# Altium schematic sheet 40_Controles.SchDoc
size A3; SheetNumber: 10; SheetTotal: 11
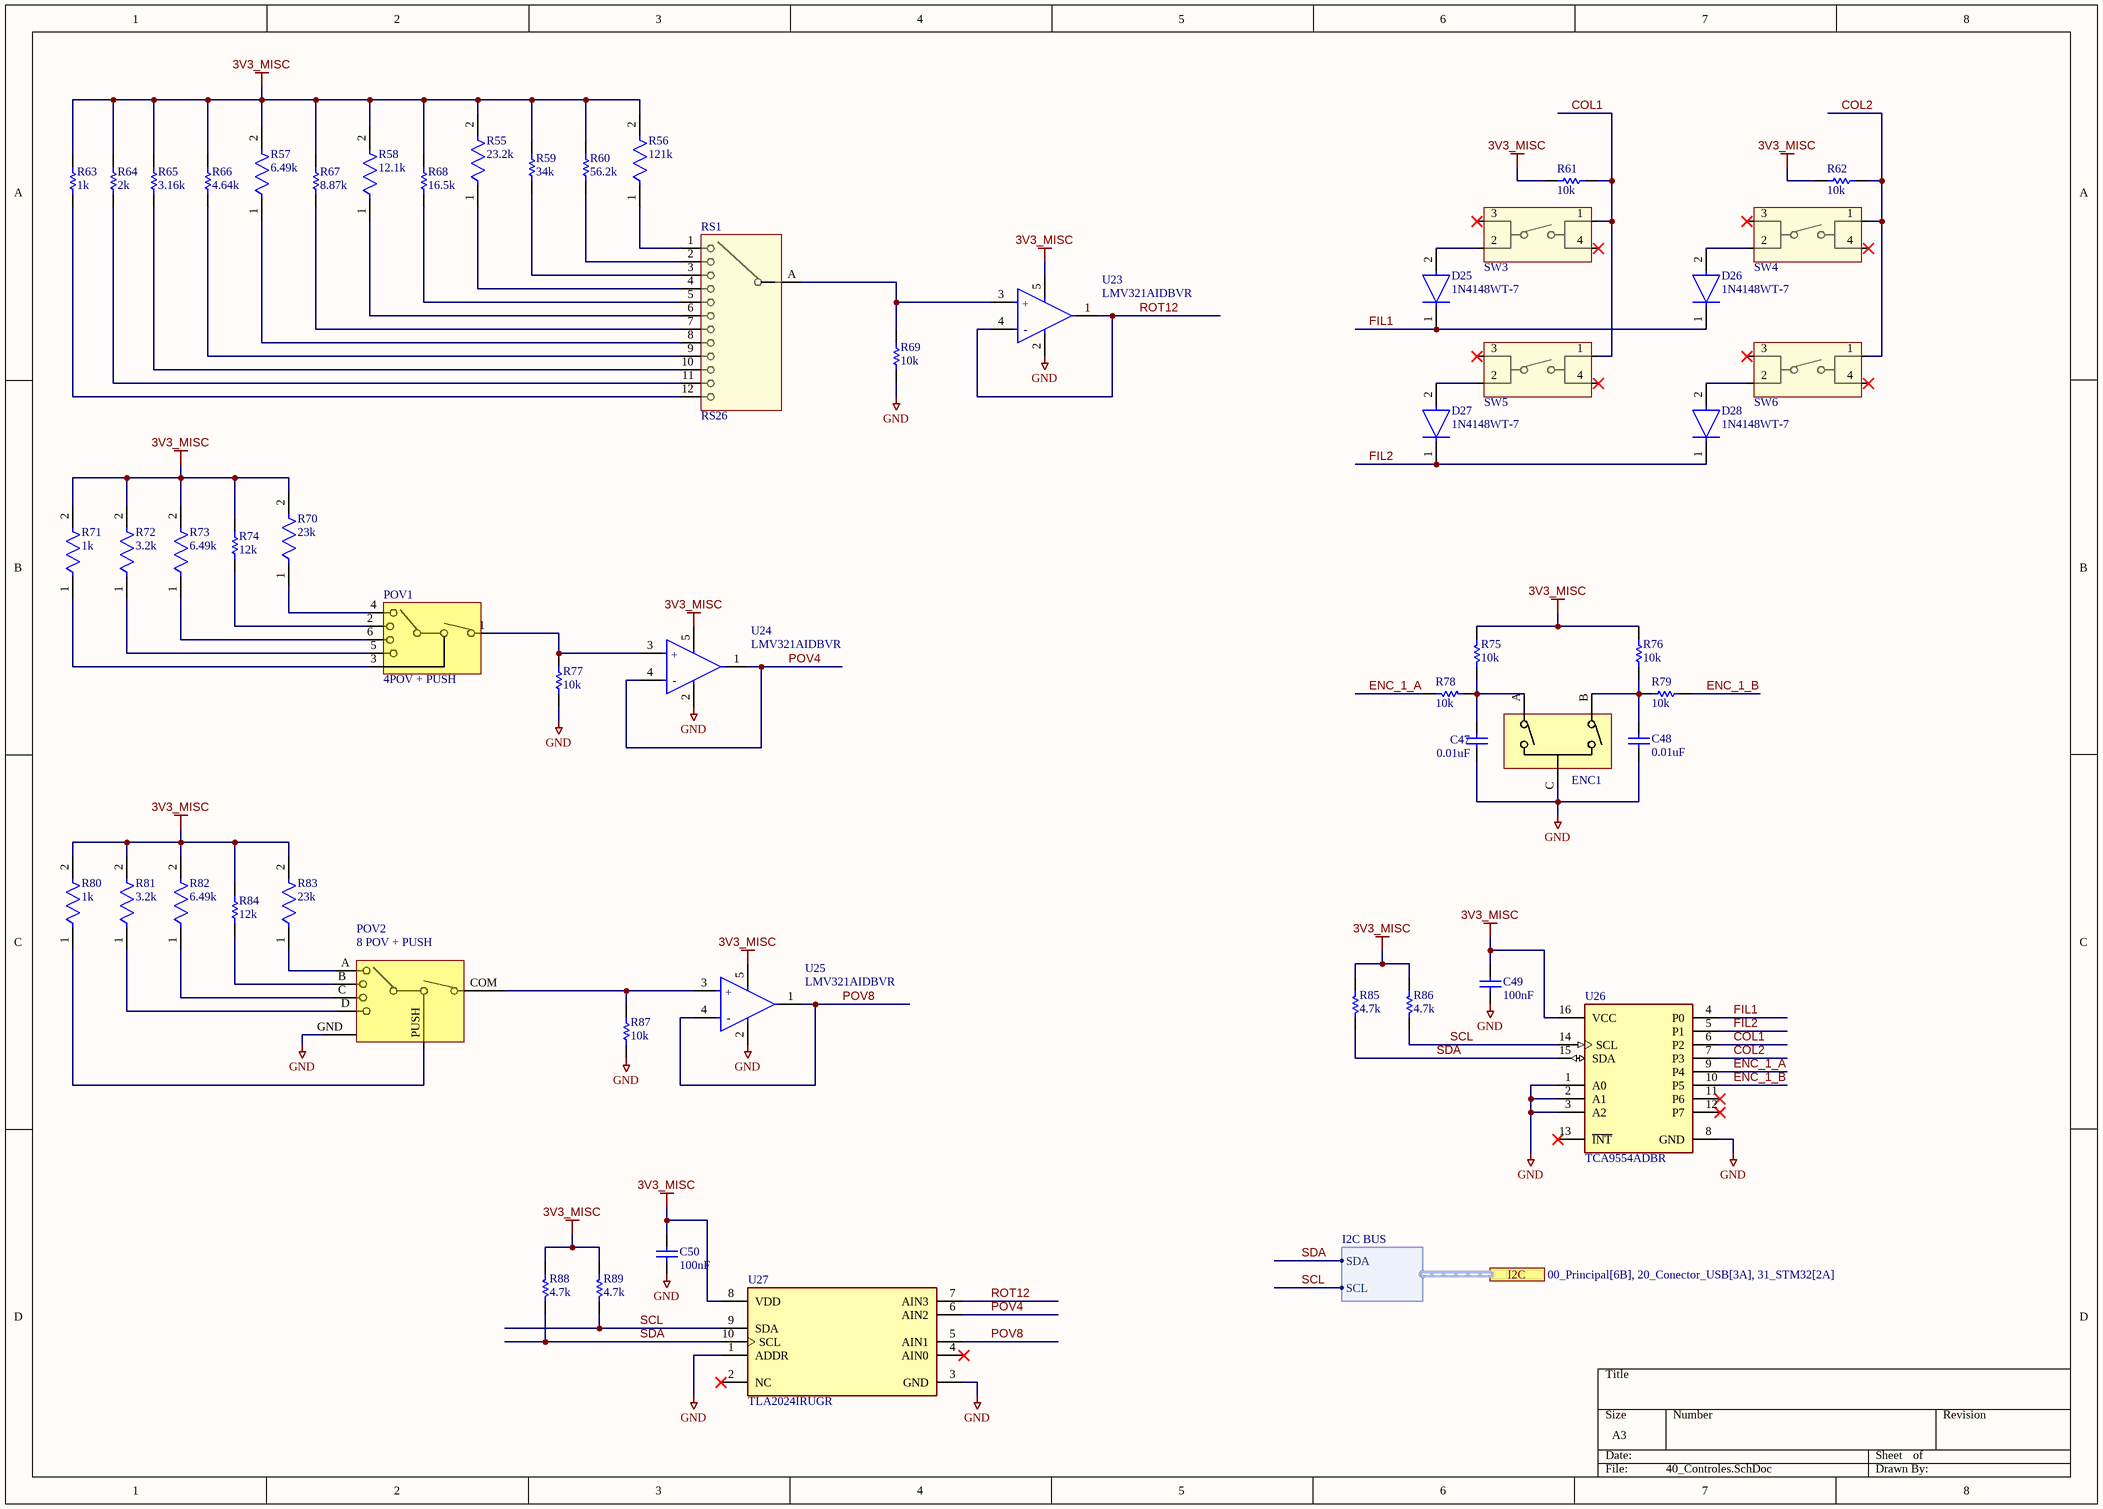
[diagram p0: 40_Controles.SchDoc]

## Parts
C47  0.01uF  [CAPC1005X55X25LL05T10]
C48  0.01uF  [CAPC1005X55X25LL05T10]
C49  100nF  [CAPC1005X55X25NL05T05]
C50  100nF  [CAPC1005X55X25NL05T05]
D25  1N4148WT-7  [FP-SOD523-MFG]
D26  1N4148WT-7  [FP-SOD523-MFG]
D27  1N4148WT-7  [FP-SOD523-MFG]
D28  1N4148WT-7  [FP-SOD523-MFG]
ENC1  Encoder  [PEC09-2315F-N0015]  (value not drawn)
POV1  4POV + PUSH  [TSSJ 30]
POV2  8 POV + PUSH  [RKJXM1015004]
R55  23.2k  [FP-ERJ2R-MFG]
R56  121k  [FP-ERJ2R-MFG]
R57  6.49k  [FP-ERJ2RK-MFG]
R58  12.1k  [FP-ERJ2RK-IPC_C]
R59  34k  [RESC1005X40X25LL05T05]
R60  56.2k  [RESC1005X40X25LL05T05]
R61  10k  [RESC1005X40X25ML05T05]
R62  10k  [RESC1005X40X25ML05T05]
R63  1k  [RESC1005X40X25NL05T05]
R64  2k  [RESC1005X40X25LL10T10]
R65  3.16k  [RESC1005X40X25ML05T05]
R66  4.64k  [RESC1005X40X25LL05T05]
R67  8.87k  [RESC1005X40X25NL05T05]
R68  16.5k  [RESC1005X40X25LL05T05]
R69  10k  [RESC1005X40X25ML05T05]
R70  23k  [FP-AC0402-MFG]
R71  1k  [FP-MCS0402-IPC_B]
R72  3.2k  [FP-RN73R1E-IPC_A]
R73  6.49k  [FP-MCS0402-IPC_A]
R74  12k  [RESC0402(1005)_M]
R75  10k  [RESC1005X40X25ML05T05]
R76  10k  [RESC1005X40X25ML05T05]
R77  10k  [RESC1005X40X25ML05T05]
R78  10k  [RESC1005X40X25ML05T05]
R79  10k  [RESC1005X40X25ML05T05]
R80  1k  [FP-MCS0402-IPC_B]
R81  3.2k  [FP-RN73R1E-IPC_A]
R82  6.49k  [FP-MCS0402-IPC_A]
R83  23k  [FP-AC0402-MFG]
R84  12k  [RESC0402(1005)_M]
R85  4.7k  [RESC1005X40X25ML05T10]
R86  4.7k  [RESC1005X40X25ML05T10]
R87  10k  [RESC1005X40X25ML05T05]
R88  4.7k  [RESC1005X40X25ML05T10]
R89  4.7k  [RESC1005X40X25ML05T10]
RS1  RS26  [RS26]
SW3  KSC441G70SHLFSPF  [KSC441G 70SH LFS PF]  (value not drawn)
SW4  KSC441G70SHLFSPF  [KSC441G 70SH LFS PF]  (value not drawn)
SW5  KSC441G70SHLFSPF  [KSC441G 70SH LFS PF]  (value not drawn)
SW6  KSC441G70SHLFSPF  [KSC441G 70SH LFS PF]  (value not drawn)
U23  LMV321AIDBVR  [FP-DBV0005A-MFG]
U24  LMV321AIDBVR  [FP-DBV0005A-MFG]
U25  LMV321AIDBVR  [FP-DBV0005A-MFG]
U26  TCA9554ADBR  [FP-DB0016A-MFG]
U27  TLA2024IRUGR  [FP-RUG0010A-MFG]

## Ports
I2C (harness I2C BUS, see 00_Principal[6B], 20_Conector_USB[3A], 31_STM32[2A])

## Harnesses
I2C BUS: SDA, SCL

## Nets
3V3_MISC: C49.2 C50.2 R55.2 R56.2 R57.2 R58.2 R59.2 R60.2 R61.2 R62.2 R63.2 R64.2 R65.2 R66.2 R67.2 R68.2 R70.2 R71.2 R72.2 R73.2 R74.2 R75.1 R76.1 R80.2 R81.2 R82.2 R83.2 R84.2 R85.2 R86.2 R88.2 R89.2 U23.5(V+) U24.5(V+) U25.5(V+) U26.16(VCC) U27.8(VDD)
GND: C47.1 C48.1 C49.1 C50.1 ENC1.C(COM) POV2.GND R69.1 R77.1 R87.1 U23.2(V-) U24.2(V-) U25.2(V-) U26.1(A0) U26.2(A1) U26.3(A2) U26.8(GND) U27.1(ADDR) U27.3(GND)
COL1: R61.1 SW3.1 SW5.1 U26.6(P2)
COL2: R62.1 SW4.1 SW6.1 U26.7(P3)
ENC_1_A: R78.1 U26.9(P4)
ENC_1_B: R79.1 U26.10(P5)
FIL1: D25.1(C) D26.1(C) U26.4(P0)
FIL2: D27.1(C) D28.1(C) U26.5(P1)
POV4: U24.1(OUT) U24.4(-IN) U27.6(AIN2)
POV8: U25.1(OUT) U25.4(-IN) U27.5(AIN1)
ROT12: U23.1(OUT) U23.4(-IN) U27.7(AIN3)
SCL: R86.1 R89.1 U26.14(SCL) U27.9(SDA) ; port I2C.SCL
SDA: R85.1 R88.1 U26.15(SDA) U27.10(SCL) ; port I2C.SDA
NetC47_2: C47.2 ENC1.A(COM) R75.2 R78.2
NetC48_2: C48.2 ENC1.B(COM) R76.2 R79.2
NetD25_2: D25.2(A) SW3.2
NetD26_2: D26.2(A) SW4.2
NetD27_2: D27.2(A) SW5.2
NetD28_2: D28.2(A) SW6.2
NetPOV1_1: POV1.1(COM) R77.2 U24.3(+IN)
NetPOV1_2: POV1.2(DIRB) R74.1
NetPOV1_3: POV1.3 R71.1
NetPOV1_4: POV1.4(DIRA) R70.1
NetPOV1_5: POV1.5(DIRD) R72.1
NetPOV1_6: POV1.6(DIRC) R73.1
NetPOV2_A: POV2.A(DIRA) R83.1
NetPOV2_B: POV2.B(DIRB) R84.1
NetPOV2_C: POV2.C(DIRC) R82.1
NetPOV2_COM: POV2.COM R87.2 U25.3(+IN)
NetPOV2_D: POV2.D(DIRD) R81.1
NetPOV2_PUSH: POV2.PUSH R80.1
NetR55_1: R55.1 RS1.4(A)
NetR56_1: R56.1 RS1.1(A)
NetR57_1: R57.1 RS1.8(A)
NetR58_1: R58.1 RS1.6(A)
NetR59_1: R59.1 RS1.3(A)
NetR60_1: R60.1 RS1.2(A)
NetR63_1: R63.1 RS1.12(A)
NetR64_1: R64.1 RS1.11(A)
NetR65_1: R65.1 RS1.10(A)
NetR66_1: R66.1 RS1.9(A)
NetR67_1: R67.1 RS1.7(A)
NetR68_1: R68.1 RS1.5(A)
NetR69_2: R69.2 RS1.A U23.3(+IN)

Not connected (* = marked no-connect by the designer): SW3 3(2)* 4(3)*; SW4 3(2)* 4(3)*; SW5 3(2)* 4(3)*; SW6 3(2)* 4(3)*; U26 11(P6)* 12(P7)* 13(~{INT})*; U27 2(NC)* 4(AIN0)*

## Notes on the sheet
- (in symbol CMP-04895-000333-1) +; -

## Library data of the parts
C47 C48 = CMP-1034-01880-2: Manufacturer: Murata; Part Number: GRM155R71E103KA01D
C49 C50 = CMP-2008-02030-1: Manufacturer: Vitramon; Part Number: VJ0402Y104KXJCW1BC
D25-D28 = CMP-2000-05518-3: DIODE GEN PURP 80V 125MA SOD523; Power Rating: 150mW; Peak Non-Repetitive Surge Current: 2A; Forward Voltage: 1.25V; Reverse Recovery Time: 4ns; Peak Reverse Current: 1uA; Max Repetitive Reverse Voltage (Vrrm): 100V; Capacitance: 2pF; Polarity: Standard; Element Configuration: Single; Forward Current: 250mA; Lead Free: Lead Free; Packaging: Tape and Reel; Length: 0.9mm; Min Operating Temperature: -65°C; Current Rating: 125mA; Max Reverse Voltage (DC): 80V; Width: 1.3mm; Package Quantity: 3000; Output Current: 125mA; Power Dissipation: 150mW; Max Operating Temperature: 150°C; Radiation Hardening: No; Average Rectified Current: 125mA; Height: 0.65mm; Voltage Rating (DC): 80V; Max Surge Current: 2A; Weight: 3.5E-05oz; Recovery Time: 4ns; Max Forward Surge Current (Ifsm): 2A; Contact Plating: Tin; Number of Pins: 2; Mount: Surface Mount; REACH SVHC: No SVHC
ENC1 = PEC09-2315F-N0015: PEC09 PC Pin Quadrature (Incremental) 12 Mechanical Encoder 11.4mm 70C; Manufacturer: Bourns; Built in Switch: No; Detent: Yes; Number of Circuits: 1; Output Type: Incremental, Quadrature; Pulses per Revolution: 12; Supplier: DigiKey; Supplier Part Number: 118-PEC09-2315F-N0015-ND; Manufacturer Part Number: PEC09-2315F-N0015; RoHS: Compliant; Category: Encoders; Stock: 1221; Pricing: 1=2.47, 10=2.078, 25=1.9392, 50=1.8398, 100=1.745, 300=1.60387, 500=1.54196, 1000=1.46156, 5000=1.29003 (USD); Country of Origin: Taiwan; Encoder Type: Mechanical; Introduction Date: 2010-10-15; Lifecycle Status: Production; Max Operating Temperature: 70°C; Min Operating Temperature: -10°C; Mounting Technology: PCB, Panel, Through Hole; Orientation: Right Angle; REACH SVHC: Yes; Schedule B: 8543709655; Termination: PC Pin; Width: 9.7mm; ComponentLink1URL: https://datasheet.octopart.com:443/PEC09-2315F-N0015-Bourns-datasheet-179971531.pdf?src-supplier=IHS; ComponentLink1Description: https://datasheet.octopart.com:443/PEC09-2315F-N0015-Bourns-datasheet-179971531.pdf?src-supplier=IHS; ComponentLink2URL: https://datasheet.octopart.com:443/PEC09-2315F-N0015-Bourns-datasheet-67810299.pdf?src-supplier=JRH+Electronics; ComponentLink2Description: https://datasheet.octopart.com:443/PEC09-2315F-N0015-Bourns-datasheet-67810299.pdf?src-supplier=JRH+Electronics; ComponentLink3URL: https://datasheet.octopart.com:443/PEC09-2315F-N0015-Bourns-datasheet-177040331.pdf?src-supplier=Burklin+Elektronik; ComponentLink3Description: https://datasheet.octopart.com:443/PEC09-2315F-N0015-Bourns-datasheet-177040331.pdf?src-supplier=Burklin+Elektronik; ComponentLink4URL: https://datasheet.octopart.com/PEC09-2315F-N0015-Bourns-datasheet-10938969.pdf; ComponentLink4Description: https://datasheet.octopart.com/PEC09-2315F-N0015-Bourns-datasheet-10938969.pdf; ComponentLink5URL: http://sigma.octopart.com:80/conflict_mineral_statement/Bourns-company-36.pdf?src-supplier=Compliance+Statements; ComponentLink5Description: http://sigma.octopart.com:80/conflict_mineral_statement/Bourns-company-36.pdf?src-supplier=Compliance+Statements
POV1 = TSSJ 30: SWITCH NAVIGATION 20MA 15V
POV2 = RKJXM1015004: 8-directional Stick Switch (with Center-push Function) RKJXM Series
R55 = CMP-1011-00662-3: RES SMD 23.2K OHM 1% 1/10W 0402; Manufacturer Part Number: ERJ-2RKF2322X; Manufacturer: Panasonic; Voltage Rating: 50V; Power Rating: 0.1W; Resistance: 23.2kΩ; Temperature Coefficient: 100%; Automotive Grade: Grade 0; Value: 23.2kΩ; Package: ERJ2R; Device Class L2: Resistors; Height: 0.4mm; Temperature Range High: +155°C; Device Class L1: Passive Components; Temperature Range Low: -55°C; Device Class L3: Chip SMD Resistors; ComponentLink2Description: Datasheet; Temperature: -55°C to +155°C; Footprint Url: https://industrial.panasonic.com/cdbs/www-data/pdf/RDA0000/DMA0000COL17.pdf; Category: Res; Automotive: Yes; ComponentLink2URL: https://industrial.panasonic.com/cdbs/www-data/pdf/RDA0000/AOA0000C304.pdf; Digikey Description: RES SMD 23.2K OHM 1% 1/10W 0402; Ipc Land Pattern Name: RESC10050X35; Tolerance: 1%; Lead Free: Yes; RoHS: TRUE; Octopart: https://octopart.com/erj-2rkf2322x-panasonic-55421023; Mouser Description: Thick Film Resistors - SMD 0402 23.2Kohms 1% AEC-Q200; Series: ERJ; Composition: Thick Film
R56 = CMP-2002-00650-2: RES SMD 121K OHM 1% 1/10W 0402; Manufacturer: Panasonic; Manufacturer Part Number: ERJ-2RKF1213X; Voltage Rating: 50V; Power Rating: 0.1W; Value: 121kΩ; Automotive Grade: Grade 0; Temperature Coefficient: 100ppm/°C; Temperature: -55°C to +155°C; Footprint Url: https://industrial.panasonic.com/cdbs/www-data/pdf/RDA0000/DMA0000COL17.pdf; RoHS: TRUE; Ipc Land Pattern Name: RESC10050X35; Automotive: Yes; ComponentLink2Description: Datasheet; Temperature Range Low: -55°C; Octopart: https://octopart.com/erj-2rkf1213x-panasonic-55420883; Category: Res; Package: ERJ2R; Mouser Description: Thick Film Resistors - SMD 0402 121Kohms 1% Tol; Device Class L2: Resistors; Device Class L3: Chip SMD Resistors; Height: 0.4mm; Device Class L1: Passive Components; Tolerance: 1%; Series: ERJ; Digikey Description: RES SMD 121K OHM 1% 1/10W 0402; Temperature Range High: +155°C; Lead Free: Yes; Composition: Thick Film; ComponentLink2URL: https://industrial.panasonic.com/cdbs/www-data/pdf/RDA0000/AOA0000C304.pdf; Resistance: 121kΩ
R57 = CMP-2002-01028-2: NexarPartId: 55421257; Max Power Dissipation: 100mW; Resistance: 6.49kΩ; Voltage Rating: 50V; Tolerance: 1%; Temperature Coefficient: 100ppm/°C; RoHS: Compliant; Number of Terminations: 2; Case Code (Metric): 1005; Schedule B: 8533210045, 8533210045; Composition: Thick Film; Lead Free: Lead Free; Length: 1mm; Voltage Rating (DC): 50V; Max Operating Temperature: 155°C; Width: 508µm; Case Code (Imperial): 0402; REACH SVHC: No SVHC; Depth: 500µm; Contact Plating: Tin; Power Rating: 100mW; Military Standard: Not; Termination: SMD/SMT; Case/Package: 0402; Min Operating Temperature: -55°C; Packaging: Cut Tape; Height: 406.4µm; Lifecycle Status: Production; Mount: Surface Mount
R58 = CMP-2002-00649-2: RES SMD 12.1K OHM 1% 1/10W 0402; Voltage Rating (DC): 50V; Power Rating: 100mW; Temperature Coefficient: 100ppm/°C; Resistance: 12.1kR; Width: 0.02inch; Military Standard: Not; Resistance Tolerance: 1%; Resistor Type: Thick Film; Voltage Rating: 50V; Case/Package: 0402; Packaging: Tape and Reel; Series: ERJ; Number of Terminations: 2; Case Code (Metric): 1005; Radiation Hardening: No; Min Operating Temperature: -55°C; Construction: Rectangular; Technology: THICK FILM; RoHS Compliant: Yes; Termination: SMD/SMT; Contact Plating: Tin; Max Operating Temperature: 155°C; Max Power Dissipation: 100mW; Tolerance: 1%; Features: Automotive AEC-Q200; Height: 0.35mm; REACH SVHC: No SVHC; Depth: 0.5mm; Case Code (Imperial): 0402; Lead Free: Lead Free; Length: 1mm; Mount: Surface Mount; Package Quantity: 1
R59 = CMP-1011-00682-2: Part Number: ERJ-2RKF3402X; Manufacturer: Panasonic
R60 = CMP-2002-00996-1: Part Number: ERJ-2RKF5622X; Manufacturer: Panasonic
R61 R62 R69 R75-R79 R87 = CMP-2002-00601-1: Manufacturer: Panasonic; Part Number: ERJ-2RHD1002X
R63 = CMP-1011-00510-4: Chip Resistor, 1 KOhm, +/- 1%, 100 mW, -55 to 155 degC, 0402 (1005 Metric), RoHS, Tape and Reel; PartNumber: ERJ-2RKF1001X; Manufacturer: Basic Passives; Voltage Rating: 50 V; Case\/Package: 0402; Resistance: 1 KOhm; Power Rating: 100 mW; DatasheetVersion: 04/2015; Radiation Hardening: No; Pins: 2; Height: 0.35 mm; RoHSCompliant: true; Case Code (Imperial): 0402; ComponentLink2Description: Datasheet; ComponentLink1Description: Manufacturer URL; PackageReference: 0402; Mount: Surface Mount; Package Quantity: 10000; Tolerance: 1%; ComponentLink1URL: http://www.panasonic.com/; PackageDescription: 2-Pin Surface Mount Device, Body 1 x 0.5 mm; Mounting Technology: Surface Mount; Case Code (Metric): 1005; ComponentLink2URL: http://industrial.panasonic.com/cdbs/www-data/pdf/RDA0000/AOA0000C86.pdf; REACH SVHC: Yes; Packaging: Tape and Reel; Max Operating Temperature: 155 degC; Min Operating Temperature: -55 degC; Width: 0.5 mm; Length: 1 mm
R64 = CMP-2002-05790-1: Manufacturer: Panasonic; Part Number: ERA-2AEB202X
R65 = CMP-2002-00861-1: Manufacturer: Panasonic; Part Number: ERJ-2RKF3161X
R66 = CMP-2002-00951-1: Part Number: ERJ-2RKF4641X; Manufacturer: Panasonic
R67 = CMP-1011-00617-2: Part Number: ERJ-2RKF8871X; Manufacturer: Panasonic
R68 = CMP-2002-00717-1: Part Number: ERJ-2RKF1652X; Manufacturer: Panasonic
R70 R83 = CMP-03412-015848-2: RES 23.2kΩ ±1% 0.063W 0402; Resistance: 23.2kR; Max Power Dissipation: 63mW; Temperature Coefficient: 100ppm/°C; Features: Moisture Resistant; Military Standard: Not; Max Operating Temperature: 155°C; RoHS Compliant: Yes; Resistor Type: Thick Film; Min Operating Temperature: -55°C; Length: 0.039inch; Height: 0.015inch; Number of Terminations: 2; Width: 0.02inch; Series: AC; Depth: 0.5mm; Tolerance: 1%; Packaging: Tape and Reel; Case/Package: 0402
R71 R80 = CMP-2002-02445-2: RES SMD 1.2K OHM 1% 1/10W 0402; Resistance: 1kR; Tolerance: 0.1%; Max Power Dissipation: 63mW; Temperature Coefficient: 25ppm/°C; Max Operating Temperature: 125°C; Min Operating Temperature: -55°C; Case/Package: 0402; Packaging: Tape and Reel; Width: 0.02inch; Lead Free: Lead Free; Number of Terminations: 2; Height: 0.015inch; Package Quantity: 10000; Length: 0.039inch; Composition: Thin Film; Contact Plating: Tin; Depth: 0.5mm; Military Standard: Not
R72 R81 = CMP-04015-034609-1: 3.2kΩ ±0.1% 0.063W, 1/16W Chip Resistor 0402 (1005 Metric) Moisture Resistant Thin Film
R73 R82 = CMP-02407-008176-1: RES SMD 1.2K OHM 1% 1/10W 0402; Temperature Coefficient: 50ppm/°C; Resistance: 6.49kR; Max Power Dissipation: 100mW; Packaging: Tape and Reel; Lead Free: Lead Free; Tolerance: 1%; Case/Package: 0402; Length: 0.039inch; Height: 0.015inch; Package Quantity: 10000; Depth: 0.5mm; Composition: Thin Film; Width: 0.02inch; Min Operating Temperature: -55°C; Number of Terminations: 2; Military Standard: Not; Max Operating Temperature: 155°C
R74 R84 = CMP-1011-00100-1: 12K 0.063W 5% 0402 (1005 Metric)  SMD; Case-Metric: 1005; Value: 12000.00 Ohm; Case-EIA: 0402; Technology: SMT; Tolerance: 5 %; Power: 0.063 W
R85 R86 R88 R89 = CMP-2002-06456-1: Manufacturer: Panasonic; Part Number: ERJ-S02F4701X
RS1 = RS26 Rotary Coder: RS26 Rotary Type Band Switch Position Switch
SW3-SW6 = KSC441G70SHLFSPF: Switch Tactile N.O. SPST Button 1VA 32VDC 50mA 4N Gull Wing SMD T/R; Manufacturer: C&K Components; Supplier: DigiKey; Supplier Part Number: CKN11980CT-ND; Manufacturer Part Number: KSC441G70SHLFSPF; RoHS: Compliant; Category: Tactile Switches; Stock: 1; Pricing: 1=1.04, 10=0.887, 25=0.8248, 100=0.7353, 250=0.6812, 500=0.64368 (USD); Contact Current Rating: 50mA; Operating Force: 4N; ComponentLink1URL: https://datasheet.octopart.com:443/KSC441G70SHLFSPF-C%26K-Components-datasheet-128529453.pdf?src-supplier=Electro+Sonic; ComponentLink1Description: https://datasheet.octopart.com:443/KSC441G70SHLFSPF-C%26K-Components-datasheet-128529453.pdf?src-supplier=Electro+Sonic; ComponentLink2URL: https://datasheet.octopart.com:443/KSC441G70SHLFSPF-C%26K-Components-datasheet-100062959.pdf?src-supplier=Future+Electronics; ComponentLink2Description: https://datasheet.octopart.com:443/KSC441G70SHLFSPF-C%26K-Components-datasheet-100062959.pdf?src-supplier=Future+Electronics; Supplier 1: DigiKey; Supplier Part Number 1: CKN11980CT-ND
U23-U25 = CMP-04895-000333-1: IC OPAMP GP 1 CIRCUIT SOT23-5; Input Bias Current: 10pA; Output Current per Channel: 40mA; Gain Bandwidth Product: 1MHz; Input Offset Voltage (Vos): 1mV; Number of Channels: 1; Operating Supply Current: 80uA; Slew Rate: 1.7V/µs; Mount: Surface Mount; Min Operating Temperature: -40°C; Packaging: Cut Tape; Case/Package: SOT-23-5; RoHS Compliant: Yes; Max Operating Temperature: 125°C; Number of Circuits: 1
U26 = CMP-04886-000016-1: IC SMBUS I/O EXPANDER I2C 16SSOP; Min Supply Voltage: 1.65V; Max Supply Voltage: 5.5V; Frequency: 400kHz; Number of I/Os: 8; Output Type: PUSH-PULL; Lead Free: Lead Free; RoHS Compliant: Yes; Packaging: Cut Tape; Series: -; Max Operating Temperature: 85°C; Min Operating Temperature: -40°C; Interface: I2C; Mount: Surface Mount; Case/Package: SSOP; Number of Pins: 16; REACH SVHC: No SVHC
U27 = CMP-04860-000013-1: IC ADC 12BIT SIGMA-DELTA 10X2QFN; Number of A/D Converters: 1; Interface: I2C; Number of Bits: 12; Sampling Rate: 3300S/s; Number of Inputs: 4; Mount: Surface Mount; Max Operating Temperature: 85°C; Min Operating Temperature: -40°C; RoHS Compliant: Yes; Packaging: Tape and Reel